# Altium schematic sheet SalidasDigitales.SchDoc
size A4; SheetNumber: 7; SheetTotal: 10
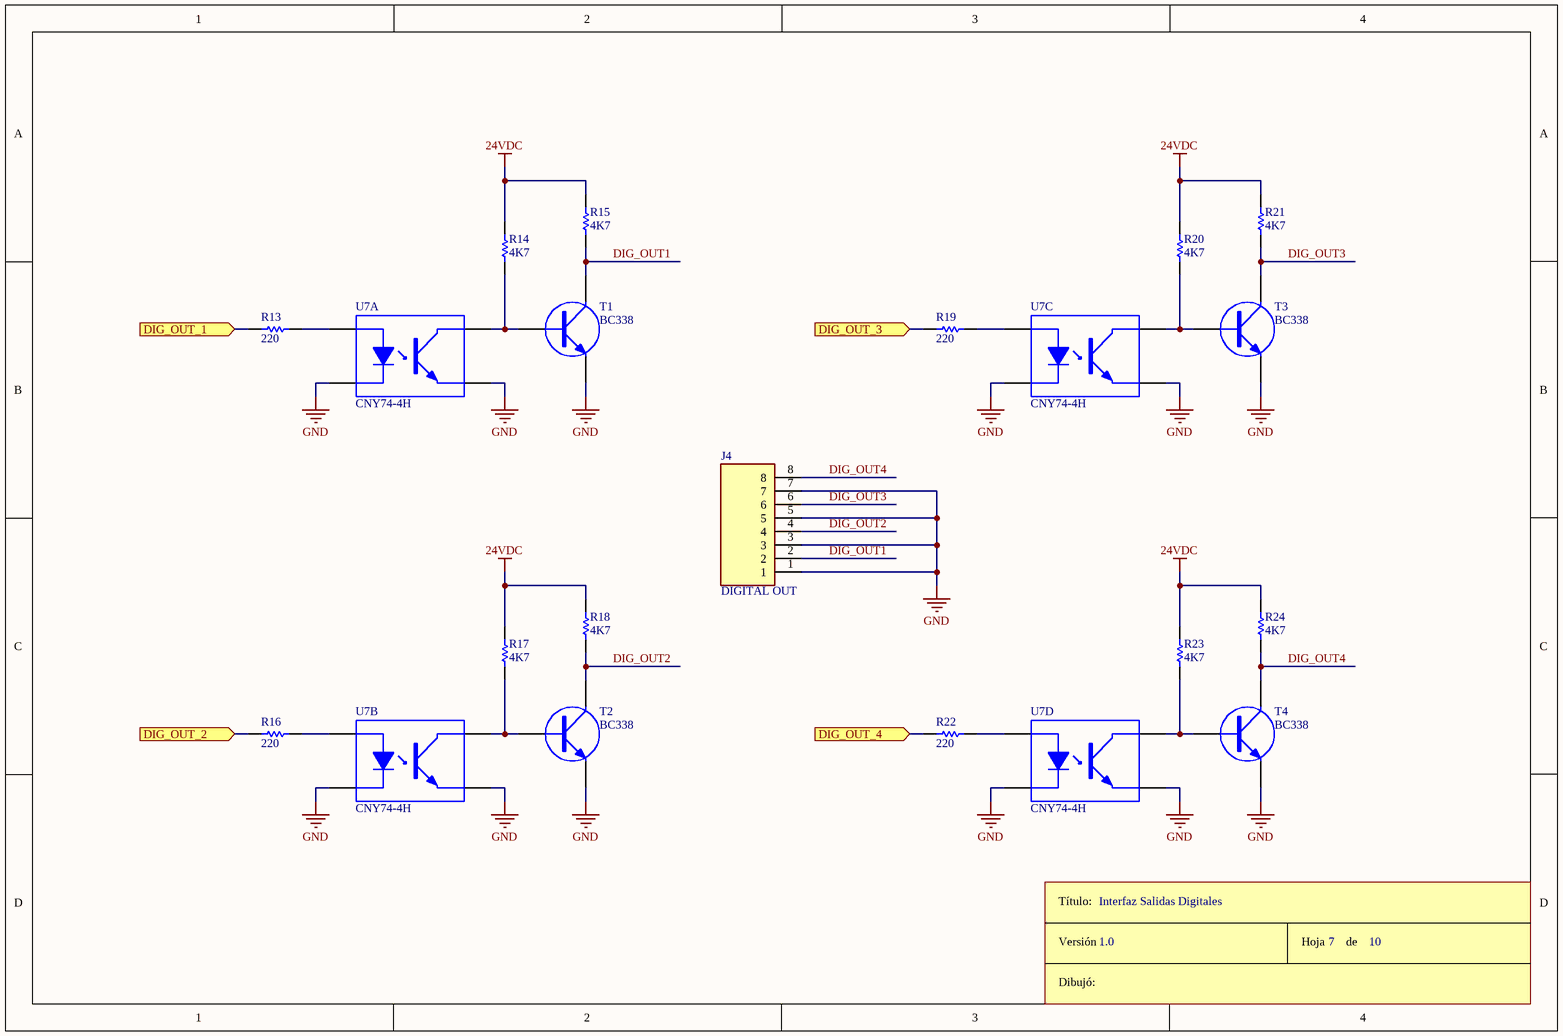
[diagram p0: SalidasDigitales.SchDoc]

## Parts
J4  DIGITAL OUT  [TE_1586863-8]
R13  220  [RES300]
R14  4K7  [RES400]
R15  4K7  [RES400]
R16  220  [RES300]
R17  4K7  [RES400]
R18  4K7  [RES400]
R19  220  [RES300]
R20  4K7  [RES400]
R21  4K7  [RES400]
R22  220  [RES300]
R23  4K7  [RES400]
R24  4K7  [RES400]
ROT6  Rótulo  (value not drawn)  (graphical)
T1  BC338  [TO92]
T2  BC338  [TO92]
T3  BC338  [TO92]
T4  BC338  [TO92]
U7  CNY74-4H  [DIP16]  (parts A,B,C,D of 4)

## Ports
DIG_OUT_1 (in), DIG_OUT_2 (in), DIG_OUT_3 (in), DIG_OUT_4 (in)

## Nets
24VDC: R14.2 R15.2 R17.2 R18.2 R20.2 R21.2 R23.2 R24.2
GND: J4.1 J4.3 J4.5 J4.7 T1.3(E) T2.3(E) T3.3(E) T4.3(E) U7.2(K) U7.3(K) U7.6(K) U7.7(K) U7.9(E) U7.12(E) U7.13(E) U7.16(E)
DIG_OUT1: J4.2 R15.1 T1.2(C)
DIG_OUT2: J4.4 R18.1 T2.2(C)
DIG_OUT3: J4.6 R21.1 T3.2(C)
DIG_OUT4: J4.8 R24.1 T4.2(C)
DIG_OUT_1: R13.1 ; port DIG_OUT_1
DIG_OUT_2: R16.1 ; port DIG_OUT_2
DIG_OUT_3: R19.1 ; port DIG_OUT_3
DIG_OUT_4: R22.1 ; port DIG_OUT_4
NetR13_2: R13.2 U7.1(A)
NetR14_1: R14.1 T1.1(B) U7.15(C)
NetR16_2: R16.2 U7.4(A)
NetR17_1: R17.1 T2.1(B) U7.14(C)
NetR19_2: R19.2 U7.5(A)
NetR20_1: R20.1 T3.1(B) U7.11(C)
NetR22_2: R22.2 U7.8(A)
NetR23_1: R23.1 T4.1(B) U7.10(C)

## Notes on the sheet
- Interfaz Salidas Digitales
- 1.0
- 7
- 10
- (in symbol Rótulo) Título:; Versión; Hoja       de; Dibujó:

## Library data of the parts
J4 = 1586863-8: Conn Power HDR 8 POS 4.2mm Solder RA Thru-Hole 8 Terminal 1 Port Tray; MF: TE Connectivity; EU_RoHS_Compliance: Compliant; SnapEDA_Link: https://www.snapeda.com/parts/1586863-8/TE%20Connectivity%20AMP%20Connectors/view-part/1404500/?ref=snap; Price: None; Package: None; Availability: Unavailable; MP: 1586863-8; TE_purchase_URL: https://www.te.com/usa-en/product-1586863-8.html?te_bu=Cor&te_type=disp&te_campaign=seda_glo_cor-seda-global-disp-prtnr-fy19-seda-model-bom-cta_sma-317_1&elqCampaignId=32493; Value: *
R13-R24 = RES
T1-T4 = TRANSISTOR NPN